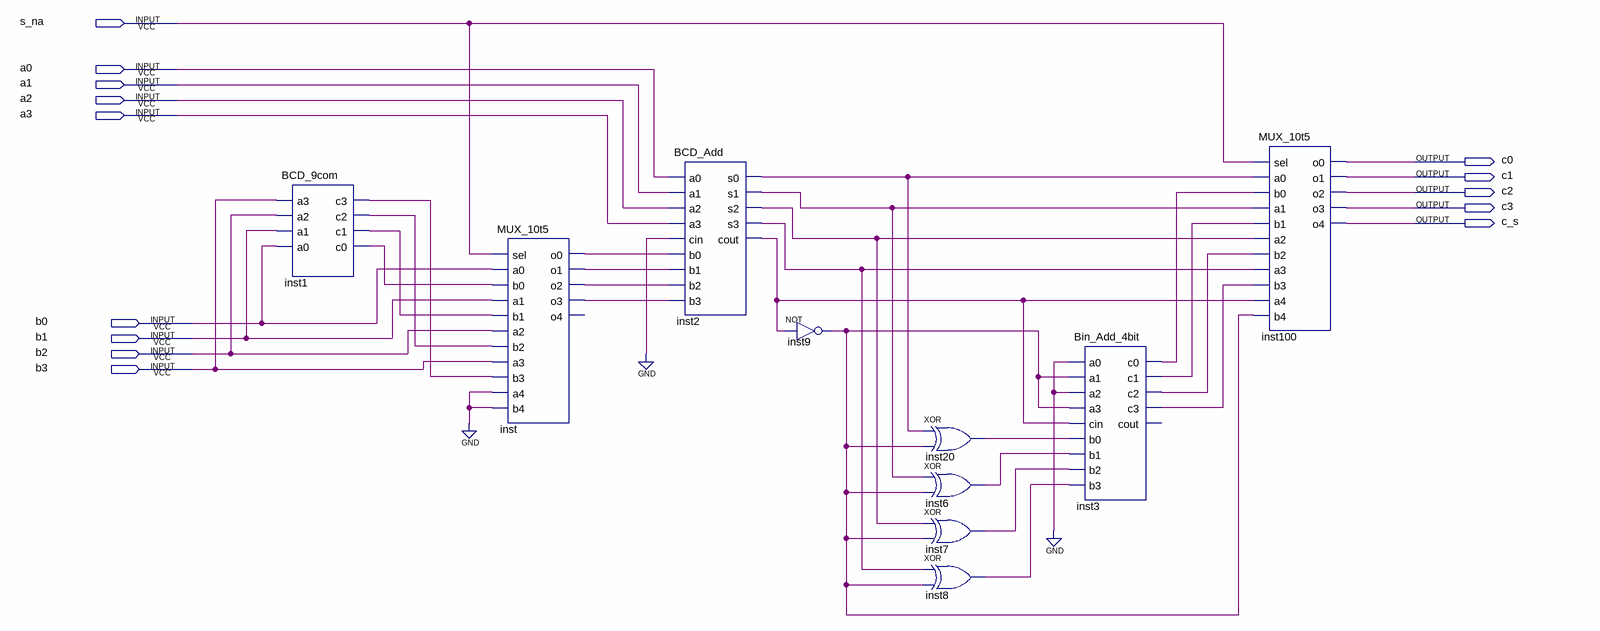
[diagram p0: schematic sheet]
// Quartus schematic BCD_Add_Sub.bdf as structural Verilog: 10 symbols, 14 pins
module BCD_Add_Sub (
  input  s_na,
  input  a0,
  input  a1,
  input  a2,
  input  a3,
  input  b0,
  input  b1,
  input  b2,
  input  b3,
  output c0,
  output c1,
  output c2,
  output c3,
  output c_s
);

  wire inst1_c0, inst1_c1, inst1_c2, inst1_c3, inst2_cout, inst2_s0, inst2_s1, inst2_s2, inst2_s3, inst3_c0,
       inst3_c1, inst3_c2, inst3_c3, inst6_out, inst7_out, inst8_out, inst9_out, inst20_out, inst_o0,
       inst_o1, inst_o2, inst_o3;

  BCD_9com inst1 (.a3(b3), .a2(b2), .a1(b1), .a0(b0), .c3(inst1_c3), .c2(inst1_c2), .c1(inst1_c1), .c0(inst1_c0));
  MUX_10t5 inst (
    .sel(s_na), .a0(b0), .b0(inst1_c0), .a1(b1), .b1(inst1_c1), .a2(b2), .b2(inst1_c2), .a3(b3),
    .b3(inst1_c3), .a4(1'b0), .b4(1'b0), .o0(inst_o0), .o1(inst_o1), .o2(inst_o2), .o3(inst_o3));  // open: o4
  BCD_Add inst2 (
    .a0(a0), .a1(a1), .a2(a2), .a3(a3), .cin(1'b0), .b0(inst_o0), .b1(inst_o1), .b2(inst_o2), .b3(inst_o3),
    .s0(inst2_s0), .s1(inst2_s1), .s2(inst2_s2), .s3(inst2_s3), .cout(inst2_cout));
  not inst9 (inst9_out, inst2_cout);
  xor inst20 (inst20_out, inst2_s0, inst9_out);
  xor inst6 (inst6_out, inst2_s1, inst9_out);
  xor inst7 (inst7_out, inst2_s2, inst9_out);
  xor inst8 (inst8_out, inst2_s3, inst9_out);
  Bin_Add_4bit inst3 (
    .a0(1'b0), .a1(inst9_out), .a2(1'b0), .a3(inst9_out), .cin(inst2_cout), .b0(inst20_out), .b1(inst6_out),
    .b2(inst7_out), .b3(inst8_out), .c0(inst3_c0), .c1(inst3_c1), .c2(inst3_c2), .c3(inst3_c3));  // open: cout
  MUX_10t5 inst100 (
    .sel(s_na), .a0(inst2_s0), .b0(inst3_c0), .a1(inst2_s1), .b1(inst3_c1), .a2(inst2_s2), .b2(inst3_c2),
    .a3(inst2_s3), .b3(inst3_c3), .a4(inst2_cout), .b4(inst9_out), .o0(c0), .o1(c1), .o2(c2), .o3(c3),
    .o4(c_s));
endmodule
